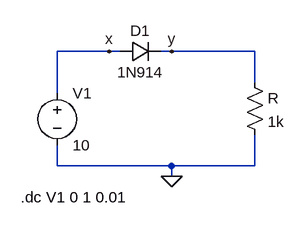
[diagram p0: schematic silicon diode forward biased.asc]
silicon diode forward biased.asc, the LTspice schematic file:
Version 4
SHEET 1 1352 680
WIRE 112 64 32 64
WIRE 128 64 112 64
WIRE 208 64 192 64
WIRE 336 64 208 64
WIRE 336 112 336 64
WIRE 32 128 32 64
WIRE 32 240 32 208
WIRE 208 240 32 240
WIRE 336 240 336 192
WIRE 336 240 208 240
WIRE 208 256 208 240
FLAG 208 256 0
FLAG 112 64 x
FLAG 208 64 y
SYMBOL diode 128 80 R270
WINDOW 0 32 32 VTop 2
WINDOW 3 0 32 VBottom 2
SYMATTR InstName D1
SYMATTR Value 1N914
SYMBOL voltage 32 112 R0
WINDOW 123 0 0 Left 0
WINDOW 39 0 0 Left 0
SYMATTR InstName V1
SYMATTR Value 10
SYMBOL res 320 96 R0
SYMATTR InstName R
SYMATTR Value 1k
TEXT -24 288 Left 2 !.dc V1 0 1 0.01

The netlist it stands for:
* silicon diode forward biased.asc
D1 x y 1N914
V1 x 0 10
R y 0 1k
.model D D
.lib standard.dio
.dc V1 0 1 0.01
.backanno
.end